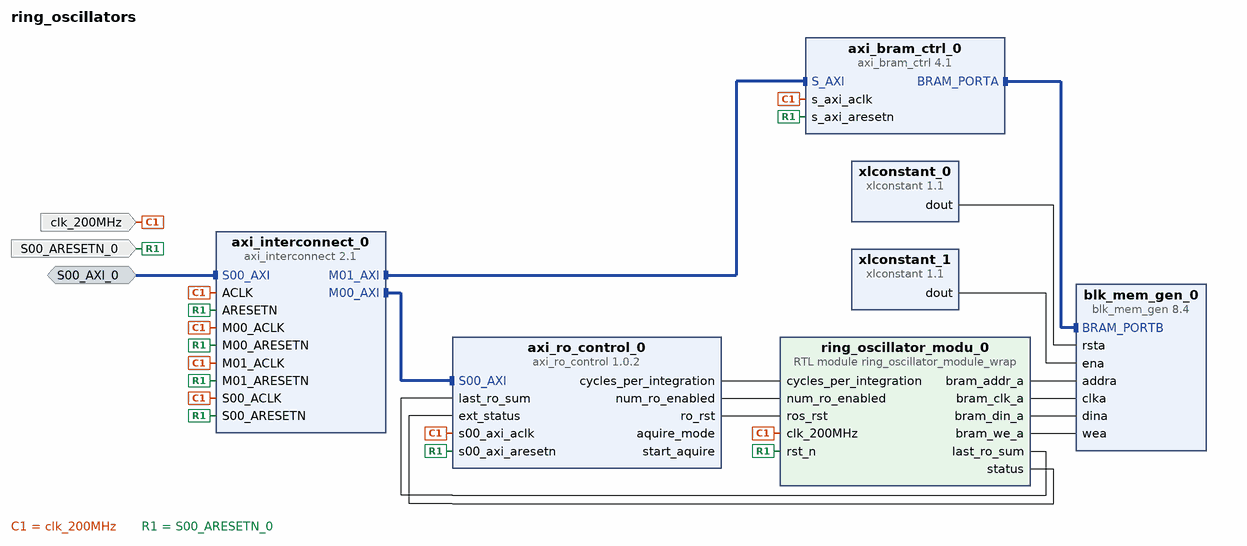
[diagram p0: block diagram of the top level]
# Vivado block design ring_oscillators, xc7z020clg400-1, Vivado 2020.1
create_bd_design ring_oscillators

create_bd_intf_port -mode Slave -vlnv xilinx.com:interface:aximm_rtl:1.0 S00_AXI_0
set_property -dict [list \
  CONFIG.DATA_WIDTH 32 \
  CONFIG.PROTOCOL AXI4 \
  CONFIG.FREQ_HZ 200000000 \
  CONFIG.ID_WIDTH 0 \
  CONFIG.ADDR_WIDTH 32 \
  CONFIG.AWUSER_WIDTH 0 \
  CONFIG.ARUSER_WIDTH 0 \
  CONFIG.WUSER_WIDTH 0 \
  CONFIG.RUSER_WIDTH 0 \
  CONFIG.BUSER_WIDTH 0 \
  CONFIG.READ_WRITE_MODE READ_WRITE \
  CONFIG.HAS_BURST 1 \
  CONFIG.HAS_LOCK 1 \
  CONFIG.HAS_PROT 1 \
  CONFIG.HAS_CACHE 1 \
  CONFIG.HAS_QOS 1 \
  CONFIG.HAS_REGION 0 \
  CONFIG.HAS_WSTRB 1 \
  CONFIG.HAS_BRESP 1 \
  CONFIG.HAS_RRESP 1 \
  CONFIG.SUPPORTS_NARROW_BURST 1 \
  CONFIG.NUM_READ_OUTSTANDING 2 \
  CONFIG.NUM_WRITE_OUTSTANDING 2 \
  CONFIG.MAX_BURST_LENGTH 256 \
  CONFIG.NUM_READ_THREADS 1 \
  CONFIG.NUM_WRITE_THREADS 1 \
  CONFIG.RUSER_BITS_PER_BYTE 0 \
  CONFIG.WUSER_BITS_PER_BYTE 0 \
] [get_bd_intf_ports S00_AXI_0]
create_bd_port -dir I -type clk clk_200MHz
set_property -dict {CONFIG.FREQ_HZ 200000000} [get_bd_ports clk_200MHz]
create_bd_port -dir I -type rst S00_ARESETN_0

create_bd_cell -type ip -vlnv xilinx.com:ip:axi_bram_ctrl:4.1 axi_bram_ctrl_0
set_property -dict [list \
  CONFIG.PROTOCOL AXI4LITE \
  CONFIG.READ_LATENCY 2 \
  CONFIG.SINGLE_PORT_BRAM 1 \
  CONFIG.USE_ECC 0 \
] [get_bd_cells axi_bram_ctrl_0]
create_bd_cell -type ip -vlnv xilinx.com:ip:blk_mem_gen:8.4 blk_mem_gen_0
set_property -dict [list \
  CONFIG.EN_SAFETY_CKT false \
  CONFIG.Enable_32bit_Address true \
  CONFIG.Enable_B Use_ENB_Pin \
  CONFIG.Memory_Type True_Dual_Port_RAM \
  CONFIG.Operating_Mode_A WRITE_FIRST \
  CONFIG.Port_B_Clock 100 \
  CONFIG.Port_B_Enable_Rate 100 \
  CONFIG.Port_B_Write_Rate 50 \
  CONFIG.Read_Width_A 32 \
  CONFIG.Read_Width_B 32 \
  CONFIG.Register_PortA_Output_of_Memory_Primitives false \
  CONFIG.Register_PortB_Output_of_Memory_Primitives false \
  CONFIG.Use_RSTA_Pin true \
  CONFIG.Use_RSTB_Pin true \
  CONFIG.Write_Width_A 32 \
  CONFIG.Write_Width_B 32 \
  CONFIG.use_bram_block BRAM_Controller \
] [get_bd_cells blk_mem_gen_0]
create_bd_cell -type ip -vlnv xilinx.com:ip:axi_interconnect:2.1 axi_interconnect_0
create_bd_cell -type ip -vlnv xilinx.com:ip:xlconstant:1.1 xlconstant_0
set_property -dict {CONFIG.CONST_VAL 0} [get_bd_cells xlconstant_0]
create_bd_cell -type ip -vlnv xilinx.com:ip:xlconstant:1.1 xlconstant_1
set_property -dict {CONFIG.CONST_VAL 1} [get_bd_cells xlconstant_1]
create_bd_cell -type ip -vlnv wiresboy.github.io:Brandon:axi_ro_control:1.0.2 axi_ro_control_0
create_bd_cell -type module -reference ring_oscillator_module_wrap ring_oscillator_modu_0

# ---- connections ----

connect_bd_intf_net [get_bd_intf_pins axi_bram_ctrl_0/BRAM_PORTA] [get_bd_intf_pins blk_mem_gen_0/BRAM_PORTB]
connect_bd_intf_net [get_bd_intf_pins axi_interconnect_0/M00_AXI] [get_bd_intf_pins axi_ro_control_0/S00_AXI]
connect_bd_intf_net -intf_net S00_AXI_0_1 [get_bd_intf_ports S00_AXI_0] [get_bd_intf_pins axi_interconnect_0/S00_AXI]
connect_bd_intf_net [get_bd_intf_pins axi_interconnect_0/M01_AXI] [get_bd_intf_pins axi_bram_ctrl_0/S_AXI]
connect_bd_net [get_bd_ports clk_200MHz] \
  [get_bd_pins axi_interconnect_0/ACLK] [get_bd_pins axi_bram_ctrl_0/s_axi_aclk] [get_bd_pins axi_interconnect_0/M01_ACLK] \
  [get_bd_pins axi_interconnect_0/M00_ACLK] [get_bd_pins axi_interconnect_0/S00_ACLK] \
  [get_bd_pins axi_ro_control_0/s00_axi_aclk] [get_bd_pins ring_oscillator_modu_0/clk_200MHz]
connect_bd_net -net S00_ARESETN_0_1 [get_bd_ports S00_ARESETN_0] \
  [get_bd_pins axi_interconnect_0/S00_ARESETN] [get_bd_pins axi_interconnect_0/M01_ARESETN] \
  [get_bd_pins axi_interconnect_0/M00_ARESETN] [get_bd_pins axi_interconnect_0/ARESETN] \
  [get_bd_pins axi_bram_ctrl_0/s_axi_aresetn] [get_bd_pins axi_ro_control_0/s00_axi_aresetn] \
  [get_bd_pins ring_oscillator_modu_0/rst_n]
connect_bd_net [get_bd_pins ring_oscillator_modu_0/last_ro_sum] [get_bd_pins axi_ro_control_0/last_ro_sum]
connect_bd_net [get_bd_pins ring_oscillator_modu_0/status] [get_bd_pins axi_ro_control_0/ext_status]
connect_bd_net [get_bd_pins axi_ro_control_0/cycles_per_integration] [get_bd_pins ring_oscillator_modu_0/cycles_per_integration]
connect_bd_net [get_bd_pins axi_ro_control_0/num_ro_enabled] [get_bd_pins ring_oscillator_modu_0/num_ro_enabled]
# net axi_ro_control_0_aquire_mode has one end: axi_ro_control_0/aquire_mode
connect_bd_net [get_bd_pins axi_ro_control_0/ro_rst] [get_bd_pins ring_oscillator_modu_0/ros_rst]
# net axi_ro_control_0_start_aquire has one end: axi_ro_control_0/start_aquire
connect_bd_net [get_bd_pins ring_oscillator_modu_0/bram_addr_a] [get_bd_pins blk_mem_gen_0/addra]
connect_bd_net [get_bd_pins ring_oscillator_modu_0/bram_clk_a] [get_bd_pins blk_mem_gen_0/clka]
connect_bd_net [get_bd_pins ring_oscillator_modu_0/bram_din_a] [get_bd_pins blk_mem_gen_0/dina]
connect_bd_net [get_bd_pins ring_oscillator_modu_0/bram_we_a] [get_bd_pins blk_mem_gen_0/wea]
connect_bd_net [get_bd_pins xlconstant_0/dout] [get_bd_pins blk_mem_gen_0/rsta]
connect_bd_net [get_bd_pins xlconstant_1/dout] [get_bd_pins blk_mem_gen_0/ena]

# ---- address map ----
assign_bd_address -offset 0x44A00000 -range 64K -target_address_space [get_bd_addr_spaces S00_AXI_0] [get_bd_addr_segs axi_bram_ctrl_0/S_AXI/Mem0]
assign_bd_address -offset 0xC0000000 -range 4K -target_address_space [get_bd_addr_spaces S00_AXI_0] [get_bd_addr_segs axi_ro_control_0/S00_AXI/S00_AXI_reg]

validate_bd_design
save_bd_design
